# Altium project PCB_Project1_5_17.PrjPcb
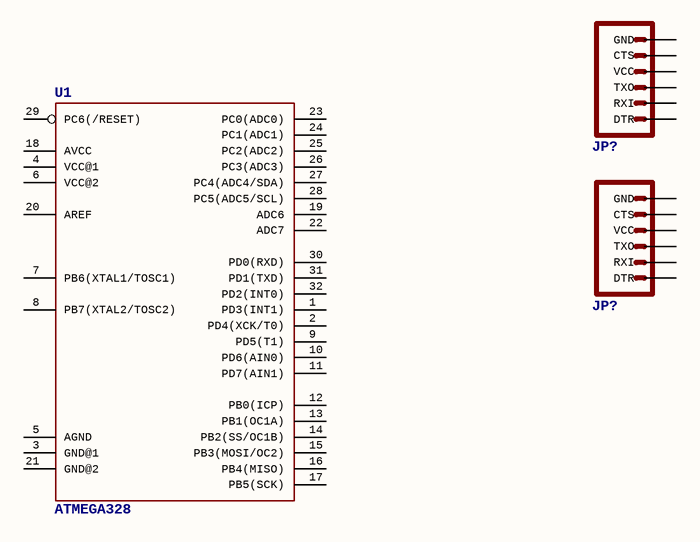
[diagram p0: Sheet1.SchDoc]
2 sheets, 3 parts. Net scope: global (net labels, ports and power ports of the same name join across sheets).
Board file: PCB1.PcbDoc
Sheets:
  Sheet1.SchDoc
  Sheet2.SchDoc

## Sheet Sheet1.SchDoc
size A

### Parts
(Parts that share a designator on the sheet are numbered #1, #2 ... from top to bottom, then left to right.)
JP?#1  ARDUINO_SERIAL_PROGRAMSMD  [1X06-SMD]  (value not drawn)
JP?#2  ARDUINO_SERIAL_PROGRAMSMD  [1X06-SMD]  (value not drawn)
U1  ATMEGA328  [TQFP32-08]

### Nets

Not connected (* = marked no-connect by the designer): JP?#1 1(DTR) 2(RXI) 3(TXO) 4(VCC) 5(CTS) 6(GND); JP?#2 1(DTR) 2(RXI) 3(TXO) 4(VCC) 5(CTS) 6(GND); U1 1(PD3(INT1)) 2(PD4(XCK/T0)) 3(GND@1) 4(VCC@1) 5(AGND) 6(VCC@2) 7(PB6(XTAL1/TOSC1)) 8(PB7(XTAL2/TOSC2)) 9(PD5(T1)) 10(PD6(AIN0)) 11(PD7(AIN1)) 12(PB0(ICP)) 13(PB1(OC1A)) 14(PB2(SS/OC1B)) 15(PB3(MOSI/OC2)) 16(PB4(MISO)) 17(PB5(SCK)) 18(AVCC) 19(ADC6) 20(AREF) 21(GND@2) 22(ADC7) 23(PC0(ADC0)) 24(PC1(ADC1)) 25(PC2(ADC2)) 26(PC3(ADC3)) 27(PC4(ADC4/SDA)) 28(PC5(ADC5/SCL)) 29(PC6(/RESET)) 30(PD0(RXD)) 31(PD1(TXD)) 32(PD2(INT0))

## Sheet Sheet2.SchDoc
size A